# EAGLE design LSM303D (EAGLE 9.0.0)
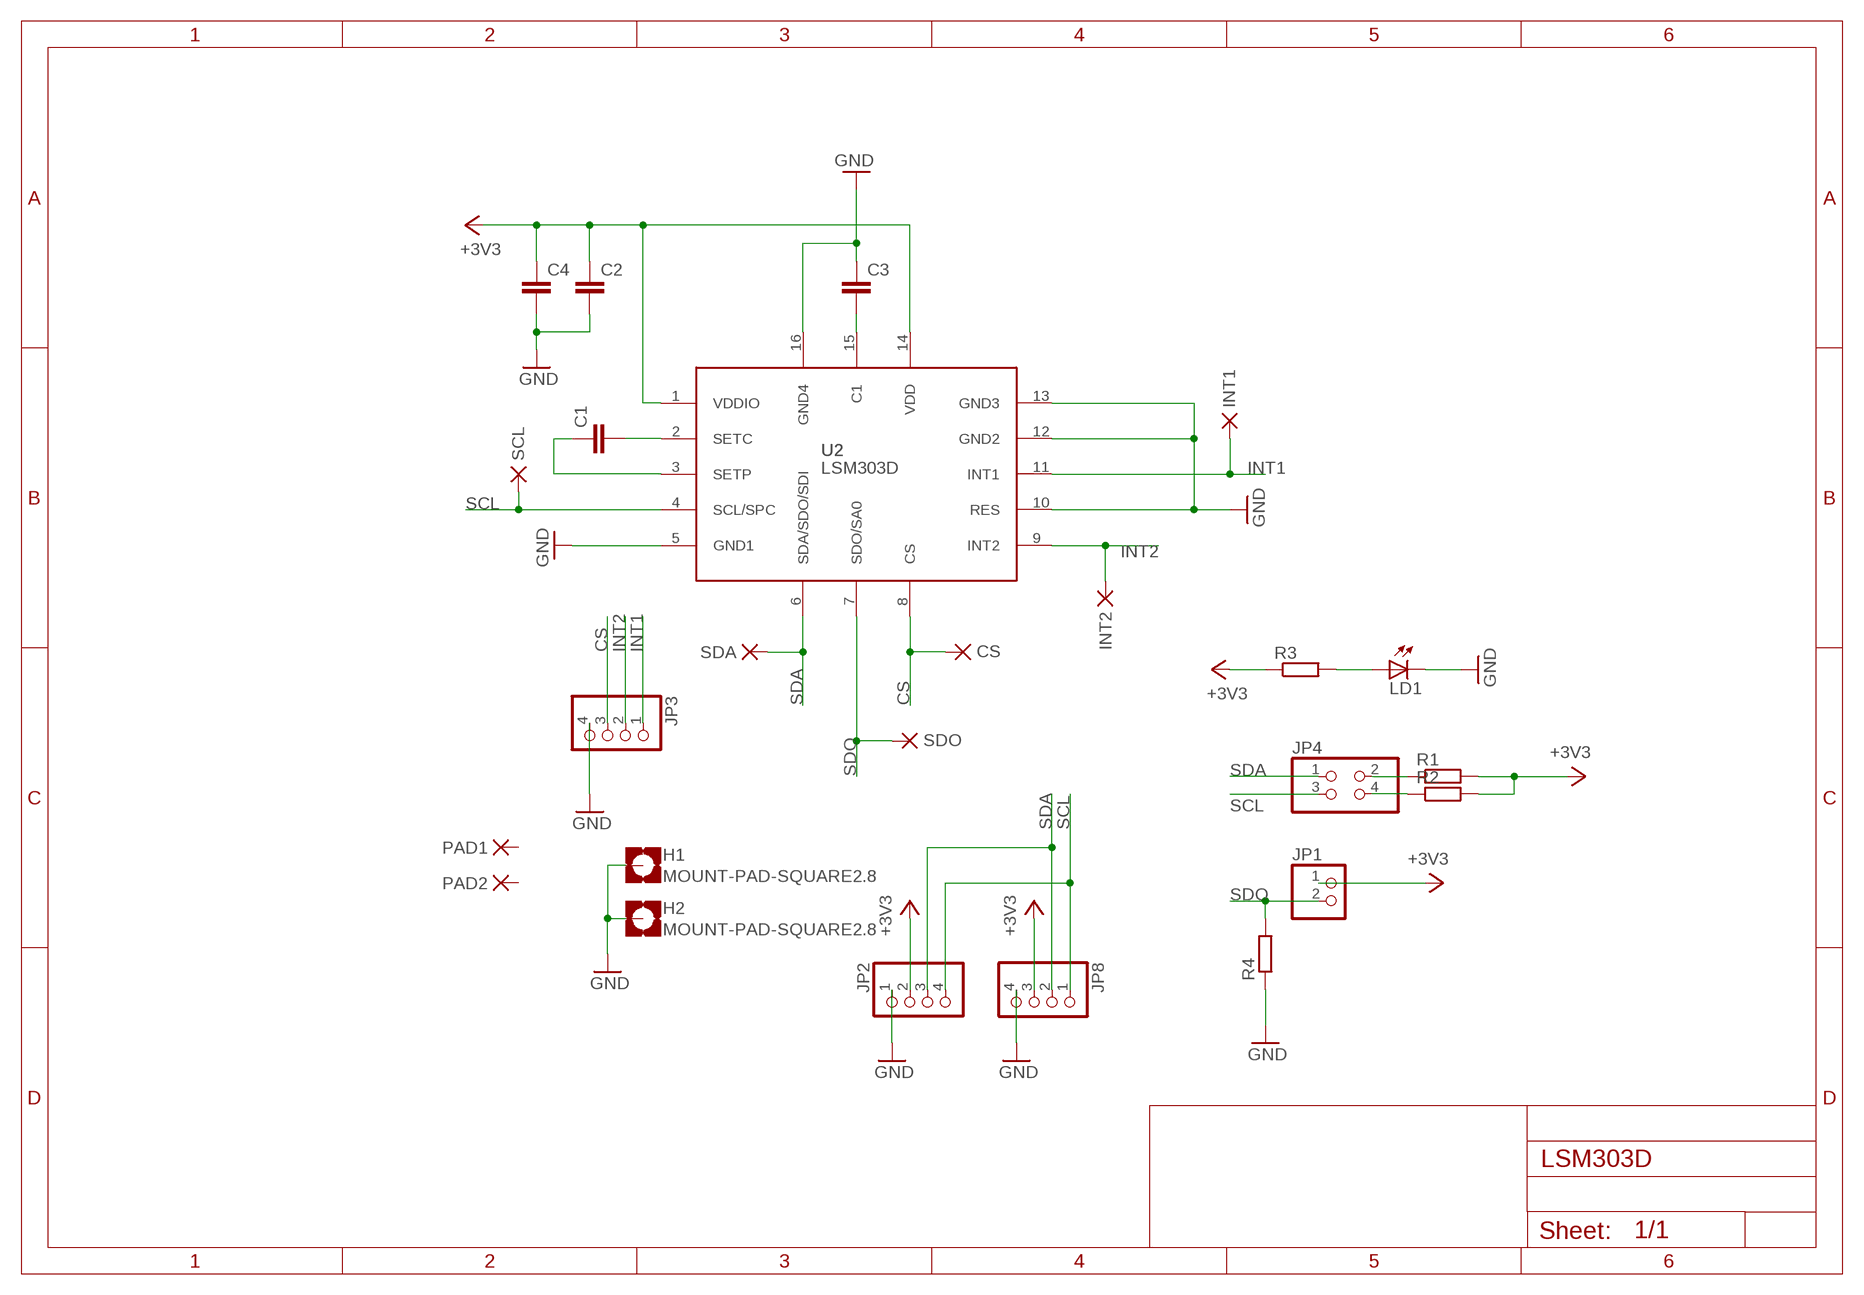
[diagram p0: schematic, sheet 1]

## Parts
C1  C-EUC0805  [C0805]
C2  C-EUC0805  [C0805]
C3  C-EUC0805  [C0805]
C4  C-EUC0805  [C0805]
CS  PAD-SMD10R  [SMD10R]
H1  MOUNT-PAD-SQUARE2.8  [2,8-PAD-SQUARE]
H2  MOUNT-PAD-SQUARE2.8  [2,8-PAD-SQUARE]
INT1  PAD-SMD10R  [SMD10R]
INT2  PAD-SMD10R  [SMD10R]
JP1  PINHD-1X2  [1X02]
JP2  PINHD-1X4_2.54-90°  [1X04/90]
JP3  PINHD-1X4  [1X04]
JP4  PINHD-2X2_2.54  [2X02]
JP8  PINHD-1X4_2.54-90°  [1X04/90]
LD1  LEDCHIPLED_0805  [CHIPLED_0805]
PAD1  PAD-SMD10R  [SMD10R]
PAD2  PAD-SMD10R  [SMD10R]
R1  R-EU_R0805  [R0805]
R2  R-EU_R0805  [R0805]
R3  R-EU_R0805  [R0805]
R4  R-EU_R0805  [R0805]
SCL  PAD-SMD10R  [SMD10R]
SDA  PAD-SMD10R  [SMD10R]
SDO  PAD-SMD10R  [SMD10R]
U2  LSM303D  [LGA16R50P3X5_300X300X100]

## Nets
+3V3: C2.1 C4.1 JP1.1 JP2.2 JP8.3 R1.2 R2.2 R3.1 U2.1(VDDIO) U2.14(VDD)
CS: CS.PAD(P) JP3.3 U2.8(CS)
GND: C2.2 C3.1 C4.2 H1.B2,8(MOUNT) H2.B2,8(MOUNT) JP2.1 JP3.4 JP8.4 LD1.C R4.1 U2.5(GND1) U2.10(RES) U2.12(GND2) U2.13(GND3) U2.16(GND4)
INT1: INT1.PAD(P) JP3.1 U2.11(INT1)
INT2: INT2.PAD(P) JP3.2 U2.9(INT2)
N$1: JP4.2 R1.1
N$2: C3.2 U2.15(C1)
N$12: LD1.A R3.2
N$15: JP4.4 R2.1
N$17: C1.2 U2.2(SETC)
N$18: C1.1 U2.3(SETP)
SCL: JP2.4 JP4.3 JP8.1 SCL.PAD(P) U2.4(SCL/SPC)
SDA: JP2.3 JP4.1 JP8.2 SDA.PAD(P) U2.6(SDA/SDO/SDI)
SDO: JP1.2 R4.2 SDO.PAD(P) U2.7(SDO/SA0)
Unconnected: PAD1.PAD(P) PAD2.PAD(P)

## Library data of the parts
C1-C4 = rcl:C-EU: CAPACITOR, European symbol
CS INT1 INT2 PAD1 PAD2 SCL SDA SDO = dpads:PAD: WIRE PAD Standard US Drill Sizes and SMD pads
H1 H2 = holes:MOUNT-PAD-SQUARE: MOUNTING PAD, square
JP1 = pinhead:PINHD-1X2: PIN HEADER
JP2 JP8 = pinhead-1:PINHD-1X4: PIN HEADER
JP3 = pinhead:PINHD-1X4: PIN HEADER
JP4 = pinhead-1:PINHD-2X2: PIN HEADER
LD1 = led:LED: LED OSRAM: - CHIPLED LG R971, LG N971, LY N971, LG Q971, LY Q971, LO R971, LY R971 LH N974, LH R974 LS Q976, LO Q976, LY Q976 LO Q996 - Hyper CHIPLED LW Q18S LB Q993, LB Q99A, LB R99A - SideLED LS A670, LO A670, LY A670, LG A670, LP A670 LB A673, LV A673, LT A673, LW A673 LH A674 LY A675 LS A676, LA A676, LO A676, LY A676, LW A676 LS A679, LY A679, LG A679 - Hyper Micro SIDELED® LS Y876, LA Y876, LO Y876, LY Y876 LT Y87S - SmartLED LW L88C, LW L88S LB L89C, LB L89S, LG L890 LS L89K, LO L89K, LY L89K LS L896, LA L896, LO L896, LY L896 - TOPLED LS T670, LO T670, LY T670, LG T670, LP T670 LSG T670, LSP T670, LSY T670, LOP T670, LYG T670 LG T671, LOG T671, LSG T671 LB T673, LV T673, LT T673, LW T673 LH T674 LS T676, LA T676, LO T676, LY T676, LB T676, LH T676, LSB T676, LW T676 LB T67C, LV T67C, LT T67C, LS T67K, LO T67K, LY T67K, LW E67C LS E67B, LA E67B, LO E67B, LY E67B, LB E67C, LV E67C, LT E67C LW T67C LS T679, LY T679, LG T679 LS T770, LO T770, LY T770, LG T770, LP T770 LB T773, LV T773, LT T773, LW T773 LH T774 LS E675, LA E675, LY E675, LS T675 LS T776, LA T776, LO T776, LY T776, LB T776 LHGB T686 LT T68C, LB T68C - Hyper Mini TOPLED® LB M676 - Mini TOPLED Santana® LG M470 LS M47K, LO M47K, LY M47K Source: http://www.osram.convergy.de/
R1-R4 = rcl:R-EU_: RESISTOR, European symbol
U2 = LSM303D:LSM303D: Ultra-compact high-performance eCompass module: 3D accelerometer and 3D magnetometer

## Board
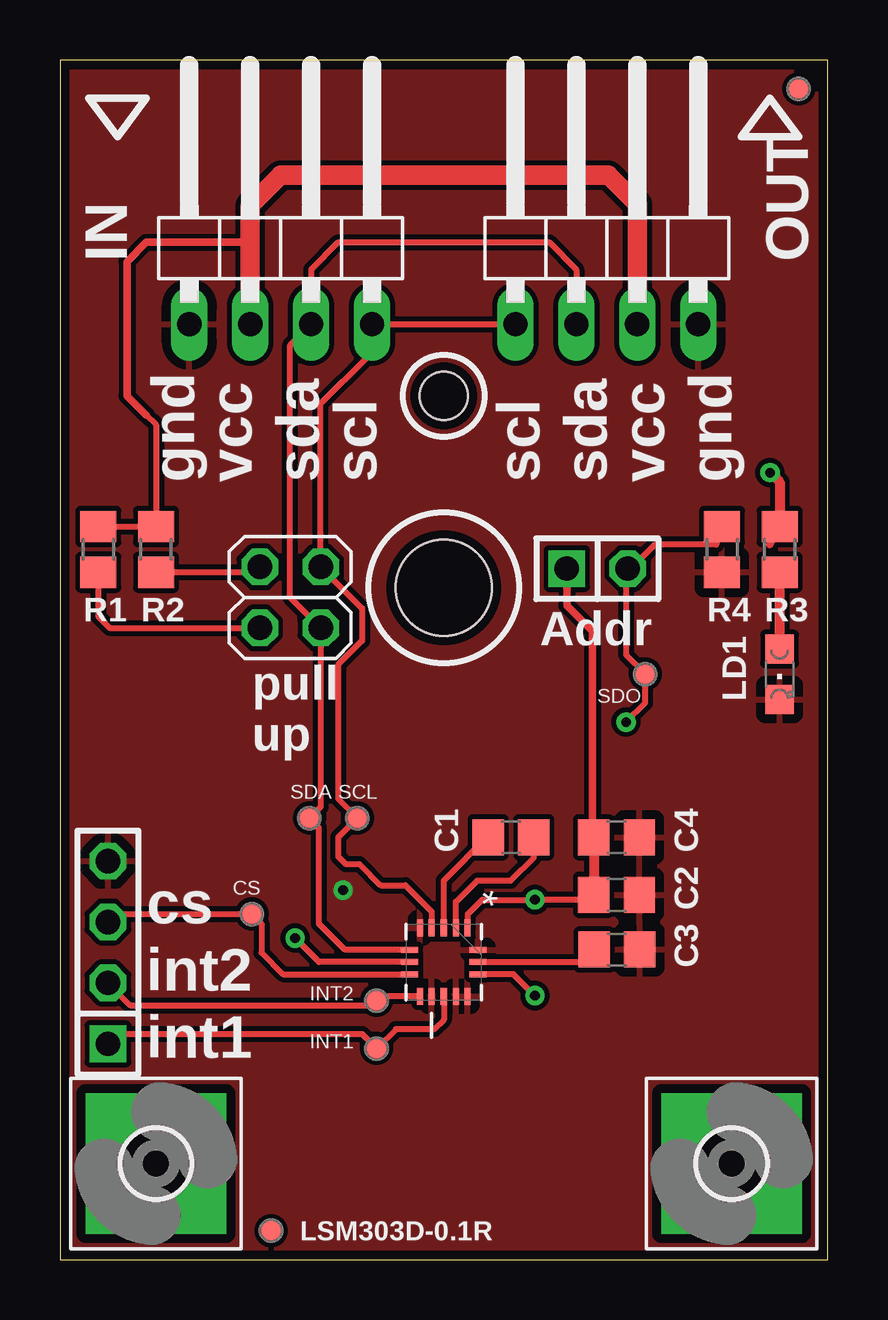
[diagram p1: board, top side]
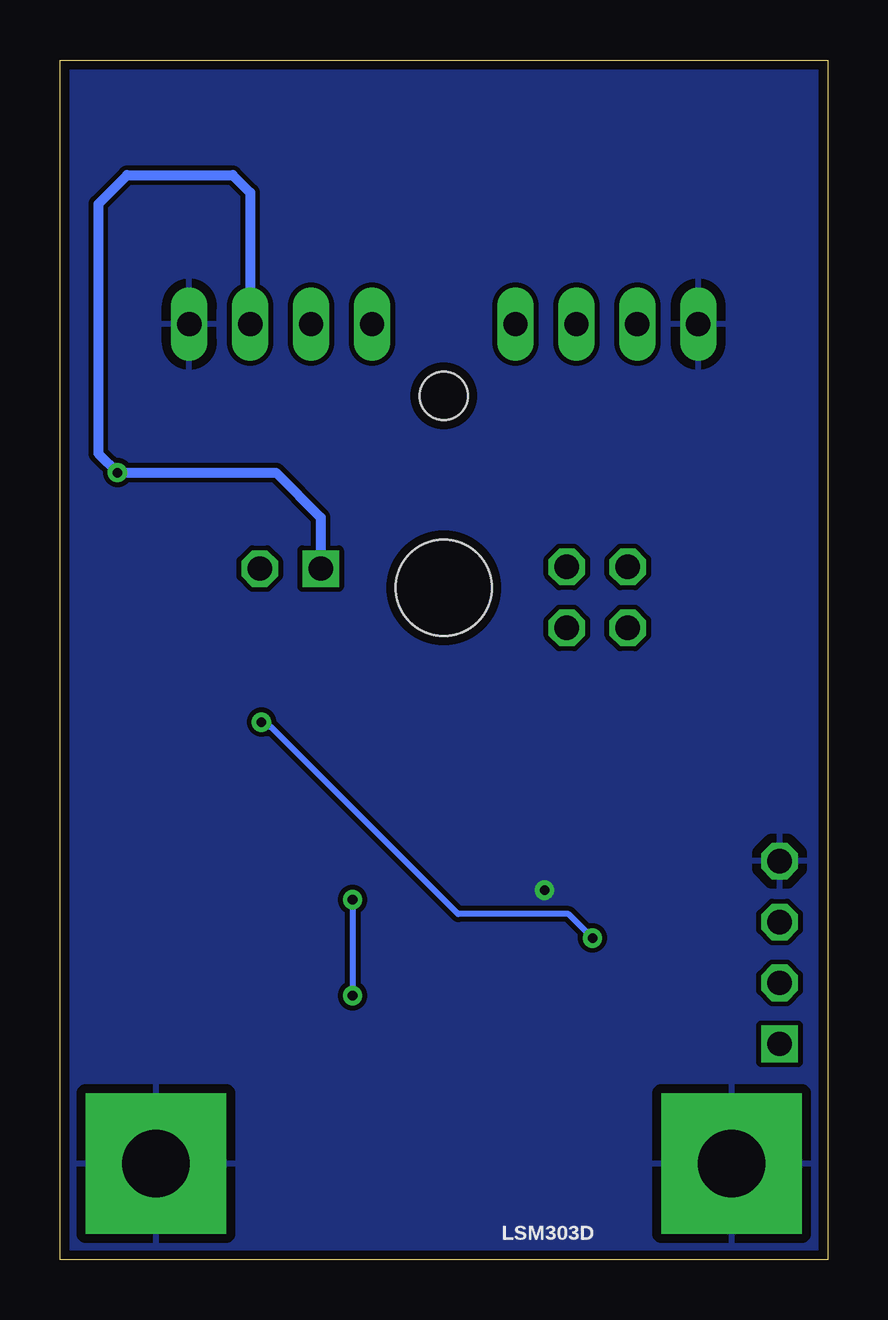
[diagram p2: board, bottom side, seen from below]

Size 32 x 50 mm. Coordinates in mm from the lower left corner, seen from the top.
Outline: 0,0 32,0 32,50 0,50 0,0
Copper layers (1*16): Top 0.035mm / dielectric 1.5mm / Bottom 0.035mm
Design rules "default *": minimum track width 10mil, minimum drill 0.6mm, track to track 8mil, track to pad 8mil, pad to pad 7mil, via to via 8mil, smd to smd 2mil, copper to edge 15mil, drill to drill 10mil, minimum pad ring 10mil, minimum via ring 8mil, stop-mask expansion 4mil, vias tented up to drill 0.6mm, thermal gap 15mil
Holes 2 mm at 16,36
Holes 4 mm at 16,28

### Footprints (pad centres in the part's own frame; a part is rotated, then mirrored left to right if it is on the bottom)
C0805 = smd 1.3 x 1.5: 1 -0.95,0; 2 0.95,0
SMD10R = smd 1 x 1: PAD 0,0
2,8-PAD-SQUARE = drill 2.8 pad 5.842 square: B2,8 0,0
1X02 = drill 1.016 square: 1 -1.27,0 | drill 1.016 octagon: 2 1.27,0
1X04/90 = drill 1.016 long: 1 -3.81,-3.81; 2 -1.27,-3.81; 3 1.27,-3.81; 4 3.81,-3.81
1X04 = drill 1.016 square: 1 -3.81,0 | drill 1.016 octagon: 2 -1.27,0; 3 1.27,0; 4 3.81,0
2X02 = drill 1.016 octagon: 1 -1.27,-1.27; 2 -1.27,1.27; 3 1.27,-1.27; 4 1.27,1.27
CHIPLED_0805 = smd 1.2 x 1.2: A 0,-1.05; C 0,1.05
R0805 = smd 1.3 x 1.5: 1 -0.95,0; 2 0.95,0
LGA16R50P3X5_300X300X100 = smd 0.711 x 0.254: 1 -1.422,0.991; 2 -1.422,0.508; 3 -1.422,0; 4 -1.422,-0.508; 5 -1.422,-0.991; 9 1.422,-0.991; 10 1.422,-0.508; 11 1.422,0; 12 1.422,0.508; 13 1.422,0.991 | smd 0.254 x 0.711: 6 -0.508,-1.422; 7 0,-1.422; 8 0.508,-1.422; 14 0.508,1.422; 15 0,1.422; 16 -0.508,1.422

### Placement (x,y rotation side)
C1  18.8,17.6 0 top
C2  23.2,15.2 0 top
C3  23.22,12.92 180 top
C4  23.2,17.6 0 top
CS  8,14.4 0 top
H1  4,4 0 top
H2  28,4 0 top
INT1  13.2,8.8 0 top
INT2  13.2,10.8 0 top
JP1  22.4,28.8 0 top
JP2  9.2,42.8 0 top
JP3  2,12.8 90 top
JP4  9.6,27.6 90 top
JP8  22.8,42.8 0 top
LD1  30,24.4 180 top
PAD1  8.8,1.2 0 top
PAD2  30.8,48.8 0 top
R1  1.6,29.6 90 top
R2  4,29.6 90 top
R3  30,29.6 270 top
R4  27.6,29.6 90 top
SCL  12.4,18.4 0 top
SDA  10.4,18.4 0 top
SDO  24.4,24.4 0 top
U2  16,12.4 270 top

### Tracks (layer width: path | path; a pad name or v marks a point on that pad's centre or on a via)
+3V3  (via drill 0.4)
  Top 0.254: C2.1 22.13,15.13 22,15 v19.8,15 17.6,15 17,14.4 17,13.83 U2.1 | v19.8,11 18.91,11.89 U2.14 | R1.2 R2.2 4,34.8 3.6,35.2
  Top 0.305: R3.1 29.6,29.8 | 3.6,35.2 2.8,36 2.8,41.6 3.6,42.4 7.93,42.4 | JP1.1 21.13,27.27 22.2,26.2 22.2,17.9 C4.1
  Top 0.406: C4.1 C2.1 | v29.6,32.8 30,32.4 R3.1
  Top 0.813: JP2.2 7.93,42.4 7.93,43.93 9.2,45.2 22.87,45.2 24.07,44 JP8.3
  Bottom 0.254: v19.8,15 v19.8,11
  Bottom 0.406: JP8.3 24.07,44.47 24.8,45.2 29.2,45.2 30.4,44 30.4,33.6 v29.6,32.8 23,32.8 21.13,30.93 JP1.1
CS
  Top 0.254: JP3.3 2.07,14.07 2.4,14.4 CS.PAD 8.4,14 8.4,12.8 9.31,11.89 U2.8
GND  (via drill 0.4)
  other vias: 11.8,15.4
  pour Top: -0.1,50 32.1,50.1 32.1,0.2 -0.1,0.1
  pour Bottom: 0,50 32,50 32,0 0,0
INT1
  Top 0.254: JP3.1 2.41,9.4 12.6,9.4 INT1.PAD 14,9.6 15.6,9.6 16,10 U2.11
INT2
  Top 0.254: JP3.2 2.93,10.6 13,10.6 INT2.PAD 13.38,10.98 U2.9
N$1
  Top 0.254: R1.1 1.6,26.8 2.07,26.33 JP4.2
  Top 0.305: R1.1 1.6,29.15
N$2
  Top 0.254: U2.15 22.15,12.4 C3.2
N$12
  Top 0.406: LD1.A R3.2
N$15
  Top 0.254: R2.1 8.11,28.65 JP4.4
  Top 0.305: R2.1 4.08,28.87
N$17
  Top 0.254: U2.2 16.51,14.91 17.4,15.8 18.8,15.8 19.75,16.75 C1.2
N$18
  Top 0.254: U2.3 16,15.8 17.85,17.65 C1.1
SCL
  Top 0.254: JP2.4 13.2,38.99 | 13.2,38.99 JP8.1 | 13.2,38.99 12.8,38.59 12.8,37.6 10.87,35.67 JP4.3 12.6,27.14 12.6,25.8 11.6,24.8 11.6,19.2 SCL.PAD 11.6,17.6 11.6,16.8 11.92,16.48 12.48,16.48 13.37,15.6 14.4,15.6 15.49,14.51 U2.4
SDA
  Top 0.254: JP4.1 9.6,27.6 9.6,38.12 JP2.3 10.47,41.27 11.6,42.4 20.4,42.4 21.53,41.27 JP8.2 | 10.8,26.26 JP4.1 | JP4.1 10.87,18.87 SDA.PAD 10.8,18 10.8,14 11.89,12.91 U2.6
SDO  (via drill 0.4)
  Top 0.254: R4.2 27.35,29.8 24.8,29.8 23.8,28.8 JP1.2 23.6,28.73 23.6,25.2 SDO.PAD 24.4,23.2 v23.6,22.4 | U2.7 10.8,12.4 v9.8,13.4
  Bottom 0.254: v9.8,13.4 10.8,14.4 15.4,14.4 23.2,22.2 23.4,22.2 v23.6,22.4 | 23.6,28.73 JP1.2

### Text on the board
tNames: IN | OUT | gnd | vcc | sda | scl | scl | sda | vcc | gnd | Addr | pull / up | cs | int2 | int1 | LSM303D-0.1R